# Altium schematic sheet ShiftRegister.SchDoc
size 420 x 297 mm; DocumentNumber: Audio core
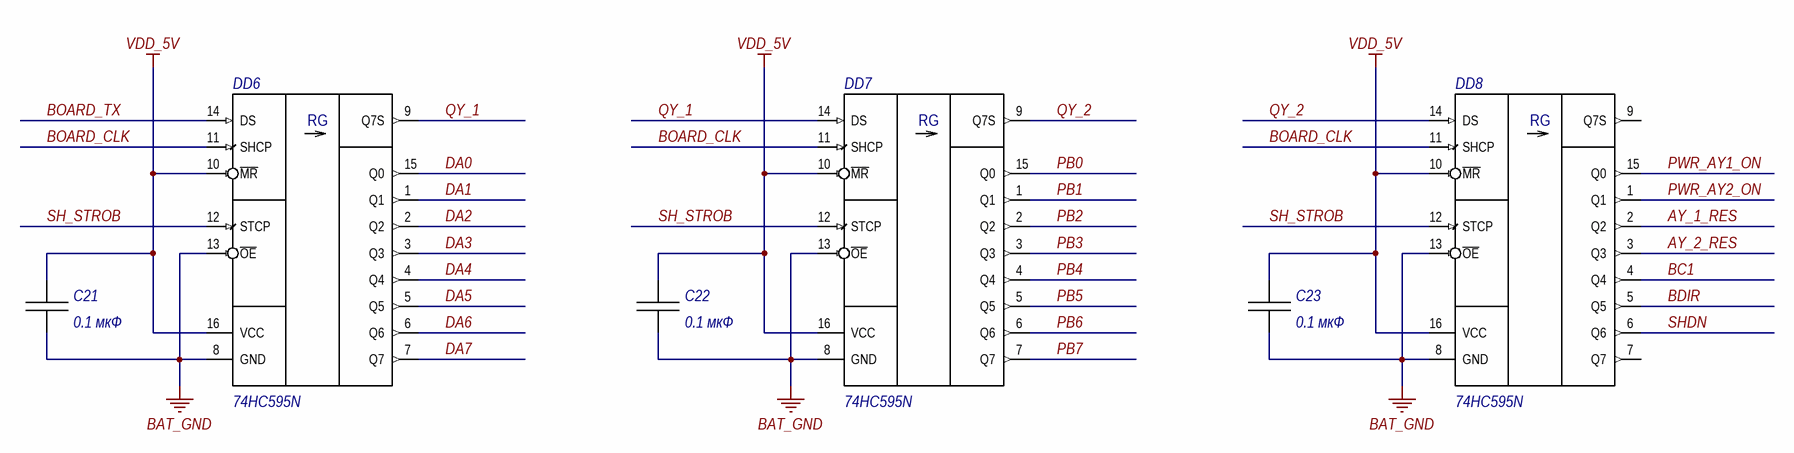
[diagram p0: ShiftRegister.SchDoc]

## Parts
C21  0.1 мкФ  [C 1206]
C22  0.1 мкФ  [C 1206]
C23  0.1 мкФ  [C 1206]
DD6  74HC595N  [SO16]
DD7  74HC595N  [SO16]
DD8  74HC595N  [SO16]

## Nets
BAT_GND: C21.2 C22.2 C23.2 DD6.8(GND) DD6.13(~{OE}) DD7.8(GND) DD7.13(~{OE}) DD8.8(GND) DD8.13(~{OE})
VDD_5V: C21.1 C22.1 C23.1 DD6.10(~{MR}) DD6.16(VCC) DD7.10(~{MR}) DD7.16(VCC) DD8.10(~{MR}) DD8.16(VCC)
AY_1_RES: DD8.2(Q2)
AY_2_RES: DD8.3(Q3)
BC1: DD8.4(Q4)
BDIR: DD8.5(Q5)
BOARD_CLK: DD6.11(SHCP) DD7.11(SHCP) DD8.11(SHCP)
BOARD_TX: DD6.14(DS)
DA0: DD6.15(Q0)
DA1: DD6.1(Q1)
DA2: DD6.2(Q2)
DA3: DD6.3(Q3)
DA4: DD6.4(Q4)
DA5: DD6.5(Q5)
DA6: DD6.6(Q6)
DA7: DD6.7(Q7)
PB0: DD7.15(Q0)
PB1: DD7.1(Q1)
PB2: DD7.2(Q2)
PB3: DD7.3(Q3)
PB4: DD7.4(Q4)
PB5: DD7.5(Q5)
PB6: DD7.6(Q6)
PB7: DD7.7(Q7)
PWR_AY1_ON: DD8.15(Q0)
PWR_AY2_ON: DD8.1(Q1)
QY_1: DD6.9(Q7S) DD7.14(DS)
QY_2: DD7.9(Q7S) DD8.14(DS)
SH_STROB: DD6.12(STCP) DD7.12(STCP) DD8.12(STCP)
SHDN: DD8.6(Q6)

Not connected (* = marked no-connect by the designer): DD8 7(Q7) 9(Q7S)

## Notes on the sheet
- Подп. и дата
- Инв. № дубл.
- Взам. инв. №
- Инв. № подл.
- Лист
- Изм.
- № докум.
- Подп.
- Дата
- Копировал
- Формат А3
- (in symbol 74HC595N) RG

## Library data of the parts
C21-C23 = CAP 1206: SMD Capacitor 1206; Manufacturer: /Укажите компанию-производителя/; Tolerance: /Укажите допуск в процентах/; Temperature coefficient: /Формат: ±? ppm/°C/; Type: Конденсатор керамический; TC: /Укажите тип диэлектрика/; Size: 1206; Temperature range: /Формат: -? ... ? °C/; Value: 0.1 мкФ